# Altium schematic sheet PowerSup.SchDoc
size A
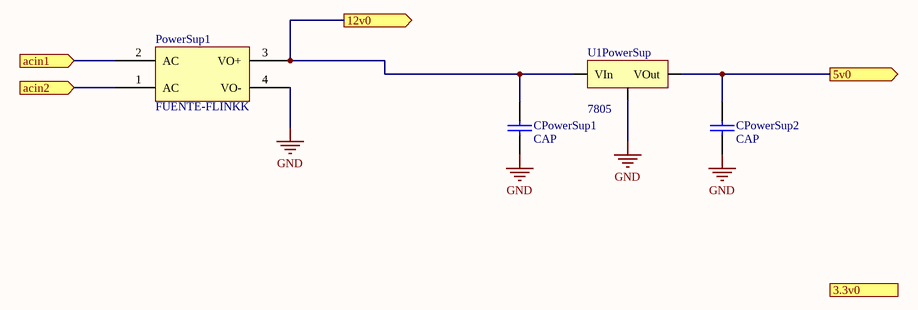
[diagram p0: PowerSup.SchDoc]

## Parts
CPowerSup1  CAP  [CAP200]
CPowerSup2  CAP  [CAP200]
PowerSup1  FUENTE-FLINKK  [FUENTE-HLINK]
U1PowerSup  7805  [TO-220 H - DISIPADOR]

## Ports
3.3v0 (out), 5v0 (out), 12v0 (out), acin1 (in), acin2 (in)

## Nets
GND: CPowerSup1.2 CPowerSup2.2 PowerSup1.4(VO-) U1PowerSup.2(GND)
5v0: CPowerSup2.1 U1PowerSup.3(VOut) ; port 5v0
12v0: CPowerSup1.1 PowerSup1.3(VO+) U1PowerSup.1(VIn) ; port 12v0
acin1: PowerSup1.2(AC) ; port acin1
acin2: PowerSup1.1(AC) ; port acin2

## Library data of the parts
U1PowerSup = 78XX: REGULDOR POSITIVO